# Altium schematic sheet Motor Control.SchDoc
size A4; SheetNumber: 1; SheetTotal: 1
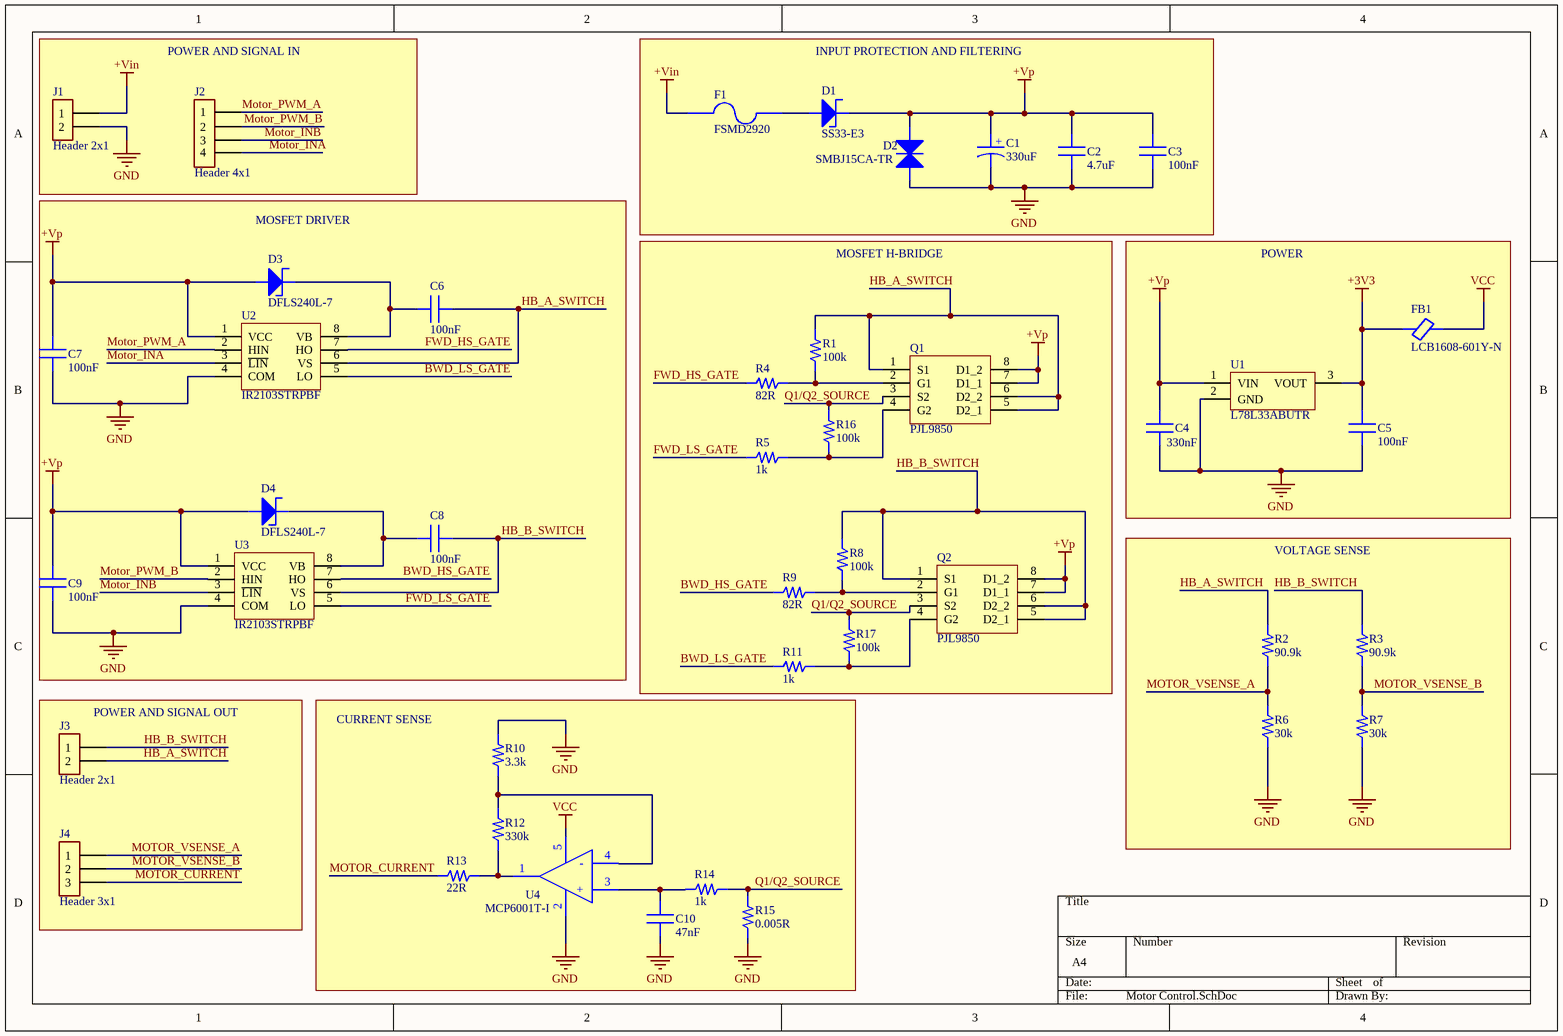
[diagram p0: Motor Control.SchDoc]

## Parts
C1  330uF  [CAP_EEEFK1V331P]
C2  4.7uF  [CAPC2012X145N 0805]
C3  100nF  [CAPC2012X145N 0805]
C4  330nF  [CAPC2012X145N 0805]
C5  100nF  [CAPC2012X145N 0805]
C6  100nF  [CAPC2012X145N 0805]
C7  100nF  [CAPC2012X145N 0805]
C8  100nF  [CAPC2012X145N 0805]
C9  100nF  [CAPC2012X145N 0805]
C10  47nF  [CAPC2012X145N 0805]
D1  SS33-E3  [SS33-E3/57T Schottky Diode]
D2  SMBJ15CA-TR  [TVS DIODE SMBJ15CA-TR]
D3  DFLS240L-7  [DIODE DFLS240L-7  POWERDI 123]
D4  DFLS240L-7  [DIODE DFLS240L-7  POWERDI 123]
F1  FSMD2920  [FUSE FSMD200-24-2920-R]
FB1  LCB1608-601Y-N  [MPZ1608S601ATA00 0603 1608X95N]
J1  Header 2x1  [2x1 Terminal Block]
J2  Header 4x1  [JST_B4B-PH-K-S 1x4 Header]
J3  Header 2x1  [2x1 Terminal Block]
J4  Header 3x1  [JST_B3B-PH-K-S 1x3 Header]
Q1  PJL9850  [PJL850 N-CH MOSFET]
Q2  PJL9850  [PJL850 N-CH MOSFET]
R1  100k  [RES 0603 ROYALOHM]
R2  90.9k  [RES 0805 YAGEO C2012X60N]
R3  90.9k  [RES 0805 YAGEO C2012X60N]
R4  82R  [RES 0805 YAGEO C2012X60N]
R5  1k  [RES 0805 YAGEO C2012X60N]
R6  30k  [RES 0805 YAGEO C2012X60N]
R7  30k  [RES 0805 YAGEO C2012X60N]
R8  100k  [RES 0603 ROYALOHM]
R9  82R  [RES 0805 YAGEO C2012X60N]
R10  3.3k  [RES 0805 YAGEO C2012X60N]
R11  1k  [RES 0805 YAGEO C2012X60N]
R12  330k  [RES 0603 ROYALOHM]
R13  22R  [RES 0603 ROYALOHM]
R14  1k  [RES 0805 YAGEO C2012X60N]
R15  0.005R  [RES 1206 YAGEO]
R16  100k  [RES 0603 ROYALOHM]
R17  100k  [RES 0603 ROYALOHM]
U1  L78L33ABUTR  [LDO L78L33ABUTR SOT89]
U2  IR2103STRPBF  [IR2103STRPBF Half Bridge Mosfet Driver]
U3  IR2103STRPBF  [IR2103STRPBF Half Bridge Mosfet Driver]
U4  MCP6001T-I  [MCP6001T-I/OT OPAMP SOT-23-5]

## Blocks framed on the sheet
POWER AND SIGNAL IN: J1 J2
INPUT PROTECTION AND FILTERING: C1-C3 D1 D2 F1
MOSFET DRIVER: C6-C9 D3 D4 U2 U3
MOSFET H-BRIDGE: Q1 Q2 R1 R4 R5 R8 R9 R11 R16 R17
POWER: C4 C5 FB1 U1
VOLTAGE SENSE: R2 R3 R6 R7
POWER AND SIGNAL OUT: J3 J4
CURRENT SENSE: C10 R10 R12-R15 U4

## Nets
+3V3: C5.2 FB1.1 U1.3(VOUT)
+Vin: F1.1 J1.1
+Vp: C1.1 C2.2 C3.2 C4.2 C7.2 C9.2 D1.K(Cathode) D2.2(C) D3.1(Anode) D4.1(Anode) Q1.7(D1_1) Q1.8(D1_2) Q2.7(D1_1) Q2.8(D1_2) U1.1(VIN) U2.1(VCC) U3.1(VCC)
GND: C1.2 C2.1 C3.1 C4.1 C5.1 C7.1 C9.1 C10.1 D2.1(A) J1.2 R6.1 R7.1 R10.2 R15.1 U1.2(GND) U2.4(COM) U3.4(COM) U4.2(VSS)
VCC: FB1.2 U4.5(VDD)
BWD_HS_GATE: R9.1 U3.7(HO)
BWD_LS_GATE: R11.1 U2.5(LO)
FWD_HS_GATE: R4.1 U2.7(HO)
FWD_LS_GATE: R5.1 U3.5(LO)
HB_A_SWITCH: C6.1 J3.2 Q1.1(S1) Q1.5(D2_1) Q1.6(D2_2) R1.2 R2.2 U2.6(VS)
HB_B_SWITCH: C8.1 J3.1 Q2.1(S1) Q2.5(D2_1) Q2.6(D2_2) R3.2 R8.2 U3.6(VS)
MOTOR_CURRENT: J4.3 R13.2
Motor_INA: J2.4 U2.3(~{LIN})
Motor_INB: J2.3 U3.3(~{LIN})
Motor_PWM_A: J2.1 U2.2(HIN)
Motor_PWM_B: J2.2 U3.2(HIN)
MOTOR_VSENSE_A: J4.1 R2.1 R6.2
MOTOR_VSENSE_B: J4.2 R3.1 R7.2
Q1/Q2_SOURCE: Q1.3(S2) Q2.3(S2) R14.1 R15.2 R16.2 R17.2
NetC6_2: C6.2 D3.2(Cathode) U2.8(VB)
NetC8_2: C8.2 D4.2(Cathode) U3.8(VB)
NetC10_2: C10.2 R14.2 U4.3(+)
NetD1_A: D1.A(Anode) F1.2
NetQ1_2: Q1.2(G1) R1.1 R4.2
NetQ1_4: Q1.4(G2) R5.2 R16.1
NetQ2_2: Q2.2(G1) R8.1 R9.2
NetQ2_4: Q2.4(G2) R11.2 R17.1
NetR10_1: R10.1 R12.2 U4.4(-)
NetR12_1: R12.1 R13.1 U4.1(Vout)

## Notes on the sheet
- (in symbol CAP Electrolytic EEE-FK1V331P) +

## Library data of the parts
C1 = CAP Electrolytic EEE-FK1V331P: 330 µF 35 V Aluminum Electrolytic Capacitors Radial, Can - SMD 2000 Hrs @ 105°C; Manufacturer: Panasonic Industry; Impedance: 80 mOhms; Ripple Current @ High Frequency: 850 mA @ 100 kHz; Voltage - Rated: 35 V; Tolerance: ±20%; ComponentLink1Description: Product Site; ComponentLink1URL: https://www.ozdisan.com/p/aluminyum-kapasitorler-180/panasoniceurope-eeefk1v331p-614518; Package / Case: Radial, Can - SMD; Operating Temperature: -55°C ~ 105°C; Lifetime @ Temp.: 2000 Hrs @ 105°C; Capacitance: 330uF; Manufacturer Product Number: EEE-FK1V331P
C2 = CAP 0805 4.7uF CL21B475KOQVPNE: MLCC (2012) 0805 4.7uF 16VDC ±10% X7R AUTOMOTIVE; Manufacturer: SAMSUNG; Capacitance: 4.7uF; Voltage Rating: 16 VDC; Dielectric: X7R; Package Size: 0805; Operating Temp.: -55 °C ~ +125 °C; Tolerance: ±10 %; Manufacturer Product Number: CL21B475KOQVPNE; ComponentLink1Description: Product Site; ComponentLink1URL: https://www.ozdisan.com/p/smt-smd-ve-mlcc-kapasitorler-184/samsung-cl21b475koqvpne-522984
C3 C5-C9 = CAP 0805 100nF CC0805JRX7R9BB104: MLCC 0805 100nF 50VDC ±10% X7R; Manufacturer: YAGEO; Tolerance: ±5 %; Capacitance: 100nF; Voltage Rating: 50VDC; Dielectric: X7R; Package Size: 0805; Operating Temp.: -55 °C ~ +125 °C; Manufacturer Code: CC0805JRX7R9BB104; ComponentLink1Description: Product Site; ComponentLink1URL: https://www.ozdisan.com/p/smt-smd-ve-mlcc-kapasitorler-184/yageo-cc0805jrx7r9bb104-748830
C4 = CAP 0805 330nF CL21B334KBFNNNE: MLCC (2012) 0805 330nF 50VDC ±10% X7R; Manufacturer: SAMSUNG; Capacitance: 330nF; Voltage Rating: 50 VDC; Dielectric: X7R; Package Size: 0805; Operating Temp.: -55 °C ~ +125 °C; Tolerance: ±10 %; Manufacturer Product Number: CL21B334KBFNNNE; ComponentLink1Description: Product Site; ComponentLink1URL: https://www.ozdisan.com/p/smt-smd-ve-mlcc-kapasitorler-184/samsung-cl21b334kbfnnne-40669
C10 = CAP 0805 47nF CL21B473KBCNNNC: CL21B473KBCNNNC; Manufacturer: SAMSUNG; Voltage Rating: 50 VDC; Dielectric: X7R; Tolerance: ±10 %; Capacitance: 47nF; Package Size: 0805; Operating Temp.: -55 °C ~ +125 °C; Manufacturer Product Number: CL21B473KBCNNNC; ComponentLink1Description: Product Site; ComponentLink1URL: https://www.ozdisan.com/p/smt-smd-ve-mlcc-kapasitorler-184/samsung-cl21b473kbcnnnc-10433
D1 = DIODE SCHOTTKY SS33-E3/57T: DIODE SCHOTTKY 30V 3A DO214AB; Manufacturer: Vishay General Semiconductor - Diodes Division; Current - Reverse Leakage @ Vr: 500 µA @ 30 V; Voltage - Forward (Vf) (Max) @ If: 500 mV @ 3 A; ComponentLink1Description: Product Site; ComponentLink1URL: https://www.ozdisan.com/p/schottky-diyotlar-385/vishay-ss33-e3-57t-366018; Operating Temperature - Junction: -55°C ~ 125°C; Package / Case: DO-214AB, SMC; Current - Average Rectified (Io): 3A; Voltage - DC Reverse (Vr) (Max): 30 V; Manufacturer Product Number: SS33-E3/57T
D2 = TVS DIODE SMBJ15CA-TR: 24.4V Clamp 25.1A Ipp Tvs Diode Surface Mount SMB; Manufacturer: STMicroelectronics; Power - Peak Pulse: 600W; Voltage - Breakdown (Min): 16.7V; Voltage - Reverse Standoff (Typ): 15V; Type: Zener; ComponentLink1Description: Product Site; ComponentLink1URL: https://www.ozdisan.com/p/tvs-diyotlar-386/stm-smbj15ca-tr-653151; Operating Temperature: -55°C ~ 150°C (TJ); Package / Case: DO-214AA, SMB; Current - Peak Pulse (10/1000µs): 25.1A; Voltage - Clamping (Max) @ Ipp: 24.4V; Manufacturer Product Number: SMBJ15CA-TR
D3 D4 = DIODE SCHOTTKY DFLS240L-7: DIODE SCHOTTK 40V 2A POWERDI 123; Manufacturer: Diodes Incorporated; Capacitance @ Vr, F: 90pF @ 10V, 1MHz; Current - Reverse Leakage @ Vr: 100 µA @ 40 V; Voltage - Forward (Vf) (Max) @ If: 500 mV @ 2 A; Package / Case: POWERDI®123; Current - Average Rectified (Io): 2A; Voltage - DC Reverse: 40 V; Manufacturer Product Number: DFLS240L-7; ComponentLink1Description: Product Site; ComponentLink1URL: https://www.ozdisan.com/p/schottky-diyotlar-385/diodes-dfls240l-7-434954
F1 = FUSE FSMD200-24-2920-R: PTC Resettable Fuse 24V 2 A Ih Surface Mount 2920 (7351 Metric), Concave; Manufacturer: RFE/Fuzetec; Resistance - Post Trip (R1) (Max): 120 mOhms; Time to Trip: 5 s; Current - Max: 100 A; Current - Trip (It): 4 A; Current - Hold (Ih) (Max): 2 A; ComponentLink1Description: Product Site; ComponentLink1URL: https://www.ozdisan.com/p/ptc-sigortalar-845/fuzetec-fsmd200-24-2920-r-537039; Operating Temperature: -40°C ~ 85°C; Package / Case: 2920 (7351 Metric); Voltage - Max: 24V; Manufacturer Product Number: FSMD200-24-2920-R
FB1 = Ferrite Bead LCB1608-601Y-N: 600 Ohms @ 100 MHz 1 Power Line Ferrite Bead 0603 (1608 Metric) 1A 200mOhm; Manufacturer: CORE MASTER; Tolerance: ±25 %; DCR: 200 m Ohms; Impedance: 600 Ohms; Current: 1 A; Package Size: 0603; Manufacturer Code: LCB1608-601Y-N; ComponentLink1Description: Product Site; ComponentLink1URL: http://ozdisan.com/p/bead-feritler-469/core-master-lcb1608-601y-n-496992
J1 J3 = Terminal Block 2x1: TERM.BLK.5.00MM 2P PCB TYPE GREEN; Manufacturer: DEGSON; Manufacturer Product Number: DG130-5.0-02P-14-00AH; Voltage: 300V; Pitch: 0.197" (5.00mm); Current: 16A; ComponentLink1Description: Product Site; ComponentLink1URL: https://www.ozdisan.com/p/pcb-klemensler-410/degson-dg130-5-0-02p-14-00ah-740967; Mounting Type: THT; Operating Temperature: -30°C ~ 120°C
J2 = Header 4x1 DS1066-4MVW6X: CON.T.B.2MM 4P 180C MALE WHITE CONNFLY; Pitch - Mating: 0.079" (2.00mm); Mounting Type: Through Hole; Contact Type: Male Pin; Series: PH; Manufacturer Product Number: DS1066-4MVW6X; Manufacturer: CONNFLY; ComponentLink1Description: Product Site; ComponentLink1URL: https://www.ozdisan.com/p/pcb-konnektorler-310/connfly-ds1066-4mvw6x-357972
J4 = Header 3x1 DS1066-3MVW6X: CON.T.B.2.00MM 3P 180C MALE CONNFLY; Pitch - Mating: 0.079" (2.00mm); Mounting Type: Through Hole; Contact Type: Male Pin; Series: PH; Manufacturer Product Number: DS1066-3MVW6X; Manufacturer: CONNFLY; ComponentLink1Description: Product Site; ComponentLink1URL: https://www.ozdisan.com/p/pcb-konnektorler-310/connfly-ds1066-3mvw6x-493781
Q1 Q2 = PJL9850 N-Ch MOSFET: Low Voltage MOSFET (20-40V,Rds(on)<1) - PJL9850 , N/N Channel, Dual, 5.4A, 40V, SOP-8; Manufacturer: PANJIT; Manufacturer Product Number: PJL9850_R2_00001; Configuration: 2 N-Channel (Dual); Current - Continuous Drain (Id) @ 25°C: 5.4A (Ta); Geometry.Height: 1.75mm; Rds On (Max) @ Id, Vgs: 32mOhm @ 5A, 10V; Gate Charge (Qg) (Max) @ Vgs: 4.4nC @ 4.5V; Drain to Source Voltage (Vdss): 40V; Datasheet Link: https://www.panjit.com.tw/en/Product/downloadPDF/PJL9850; ComponentLink1Description: Product Site; ComponentLink1URL: https://www.ozdisan.com/p/discrete-mosfetler-435/panjit-pjl9850-r2-00001-601739; Operating Temperature: -55°C ~ 150°C (TJ); Package / Case: SOP8
R1 R8 R16 R17 = RES 0603 100k 0603SAF1003T5E: RES.(1608) 0603 100K Ohms 1% 1/10W-S 100PPM; Manufacturer: ROYALOHM; Power (Watts): 0.1W, 1/10W; Tolerance: ±5 %; Operating Temperature: -55°C ~ 155°C; Package / Case: 0603 (1608 Metric); Manufacturer Product Number: 0603SAF1003T5E; Resistance: 100 kOhms; ComponentLink1Description: Product Site; ComponentLink1URL: https://www.ozdisan.com/p/smt-smd-ve-cip-direncler-194/royalohm-0603saf1003t5e-339374
R2 R3 = RES 0805 90.9k Ohms 0805S8F9092T5E: RES.(2012) 0805 90.9K Ohms 1% 1/8W-S 100PPM; Manufacturer: ROYALOHM; Power: 1/8W; Max Working Current: 5A; Max Working Voltage: 150VDC; Resistance: 90.9k Ohms; Tolerance: ±1 %; Package / Case: 0805; Manufacturer Code: 0805S8F9092T5E; ComponentLink1Description: Product Site; ComponentLink1URL: https://www.ozdisan.com/p/smt-smd-ve-cip-direncler-194/royalohm-0805s8f9092t5e-505592
R4 R9 = RES 0805 82 Ohms 0805S8J0820T5E: RES.(2012) 0805 82 Ohms 5% 1/8W-S 200PPM; Manufacturer: ROYALOHM; Resistance: 82 Ohms; Power: 1/8W; Tolerance: ±1 %; Max Working Current: 5A; Max Working Voltage: 150; Package / Case: 0805; Manufacturer Code: 0805S8J0820T5E; ComponentLink1Description: Product Site; ComponentLink1URL: https://www.ozdisan.com/p/smt-smd-ve-cip-direncler-194/royalohm-0805s8j0820t5e-341837
R5 R11 R14 = RES 0805 1k Ohms 0805S8F1001TDE: RES.(2012) 0805 1K Ohms 1% 1/8W-S 100PPM; Manufacturer: ROYALOHM; Resistance: 1k Ohms; Power: 1/8W; Max Working Current: 5A; Max Working Voltage: 150VDC; Tolerance: ±1 %; Package / Case: 0805; Manufacturer Code: 0805S8F1001TDE; ComponentLink1Description: Product Site; ComponentLink1URL: https://www.ozdisan.com/p/smt-smd-ve-cip-direncler-194/royalohm-0805s8f1001tde-356631
R6 R7 = RES 0805 30k Ohms 0805S8F3002T5E: RES.(2012) 0805 30K Ohms 1% 1/8W-S 100PPM; Manufacturer: ROYALOHM; Power: 1/8W; Max Working Current: 5A; Max Working Voltage: 150VDC; Resistance: 30k Ohms; Tolerance: ±1 %; Package / Case: 0805; Manufacturer Code: 0805S8F3002T5E; ComponentLink1Description: Product Site; ComponentLink1URL: https://www.ozdisan.com/p/smt-smd-ve-cip-direncler-194/royalohm-0805s8f3002t5e-347205
R10 = RES 0805 3.3k Ohms 0805S8F3301TDE: RES.(2012) 0805 3.3K Ohms 1% 1/8W-S 100PPM; Manufacturer: ROYALOHM; Power: 1/8W; Max Working Current: 5A; Max Working Voltage: 150VDC; Resistance: 3.3k Ohms; Tolerance: ±1 %; Package / Case: 0805; Manufacturer Code: 0805S8F3301TDE; ComponentLink1Description: Product Site; ComponentLink1URL: https://www.ozdisan.com/p/smt-smd-ve-cip-direncler-194/royalohm-0805s8f3301tde-502827
R12 = RES 0603 330k 0603SAF3303T5E: RES.(1608) 0603 330K Ohms 1% 1/10W-S 100PPM; Manufacturer: ROYALOHM; Power (Watts): 0.1W, 1/10W; Tolerance: ±5 %; Operating Temperature: -55°C ~ 155°C; Package / Case: 0603 (1608 Metric); Manufacturer Product Number: 0603SAF3303T5E; Resistance: 330 kOhms; ComponentLink1Description: Product Site; ComponentLink1URL: https://www.ozdisan.com/p/smt-smd-ve-cip-direncler-194/royalohm-0603saf3303t5e-358867
R13 = RES 0603 22 Ohms 0603SAJ0220T5E: RES.(1608) 0603 22 Ohms 5% 1/10W-S 200PPM; Manufacturer: ROYALOHM; Power (Watts): 0.1W, 1/10W; Resistance: 22 Ohms; Operating Temperature: -55°C ~ 155°C; Package / Case: 0603 (1608 Metric); Tolerance: ±5%; Manufacturer Product Number: 0603SAJ0220T5E; ComponentLink1Description: Product Site; ComponentLink1URL: https://www.ozdisan.com/p/smt-smd-ve-cip-direncler-194/royalohm-0603saj0220t5e-341987
R15 = RES 1206 5 mOhms PE1206FRF070R005L: RES.(3216) 1206 5m Ohms 1% 1/4W 100PPM AEC-Q200 SM; Manufacturer: YAGEO; Resistance: 5 mOhms; Max Working Current: 5A; Max Working Voltage: 150; Power: 1/4W; Tolerance: ±1 %; Package / Case: 0805; Manufacturer Code: PE1206FRF070R005L; ComponentLink1Description: Product Site; ComponentLink1URL: https://www.ozdisan.com/p/smt-smd-ve-cip-direncler-194/yageo-pe1206frf070r005l-854695
U1 = LDO L78L33ABUTR: Linear Voltage Regulator IC Positive Fixed 1 Output 100mA SOT-89-3; Manufacturer: STMicroelectronics; Current - Supply (Max): 6 mA; Current - Quiescent (Iq): 5.5 mA; Voltage - Output (Min/Fixed): 3.3V; Voltage - Input (Max): 30V; ComponentLink1Description: Product Site; ComponentLink1URL: https://www.ozdisan.com/p/lineer-voltaj-regulatorleri-279/stm-l78l33abutr-350187; Current - Output: 100mA; Output Type: Fixed; Manufacturer Product Number: L78L33ABUTR
U2 U3 = IR2103STRPBF Half Bridge MOSFET Driver: Half-Bridge Gate Driver IC Inverting, Non-Inverting 8-SOIC; Manufacturer: Infineon Technologies; High Side Voltage - Max (Bootstrap): 600 V; Rise / Fall Time (Typ): 100ns, 50ns; Current - Peak Output (Source, Sink): 210mA, 360mA; Logic Voltage - VIL, VIH: 0.8V, 3V; Voltage - Supply: 10V ~ 20V; Gate Type: IGBT, MOSFET (N-Channel); Number of Drivers: 2; ComponentLink1Description: Product Site; ComponentLink1URL: https://www.ozdisan.com/p/guc-surucu-entegreleri-270/ir-ir2103strpbf-468696; Package / Case: 8-SOIC; Driven Configuration: Half-Bridge; Manufacturer Product Number: IR2103STRPBF
U4 = MCP6001T-I/OT OP-AMP 1 CH LOW POWER: Standard (General Purpose) Amplifier 1 Circuit Rail-to-Rail SOT-23-5; Manufacturer: Microchip Technology; Voltage - Supply Span (Min) - (Max): 1.8V to 6V; Voltage - Input Offset: 4.5 mV; Current - Output / Channel: 23 mA; Current - Supply: 100µA; Gain Bandwidth Product: 1 MHz; Operating Temperature: -40°C ~ 85°C; Output Type: Rail-to-Rail; Manufacturer Product Number: MCP6001T-I/OT; Package / Case: SOT-23-5; ComponentLink1Description: Product Site; ComponentLink1URL: https://www.ozdisan.com/p/amplifikatorler-242/microchip-mcp6001t-i-ot-40820